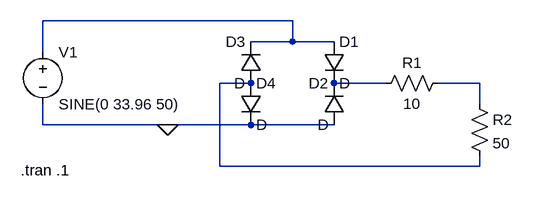
[diagram p0: schematic Rectificador.asc]
Rectificador.asc, the LTspice schematic file:
Version 4
SHEET 1 880 680
WIRE 448 112 64 112
WIRE 448 144 448 112
WIRE 448 144 384 144
WIRE 512 144 448 144
WIRE 64 160 64 112
WIRE 384 208 336 208
WIRE 592 208 512 208
WIRE 736 208 672 208
WIRE 736 240 736 208
WIRE 64 272 64 240
WIRE 256 272 64 272
WIRE 384 272 256 272
WIRE 512 272 384 272
WIRE 336 336 336 208
WIRE 736 336 736 320
WIRE 736 336 336 336
FLAG 256 272 0
SYMBOL voltage 64 144 R0
WINDOW 123 0 0 Left 0
WINDOW 39 0 0 Left 0
SYMATTR InstName V1
SYMATTR Value SINE(0 33.96 50)
SYMBOL diode 496 144 R0
SYMATTR InstName D1
SYMBOL diode 528 272 R180
WINDOW 0 24 64 Left 2
WINDOW 3 24 0 Left 2
SYMATTR InstName D2
SYMBOL diode 400 208 R180
WINDOW 0 24 64 Left 2
WINDOW 3 24 0 Left 2
SYMATTR InstName D3
SYMBOL diode 368 208 R0
SYMATTR InstName D4
SYMBOL res 688 192 R90
WINDOW 0 0 56 VBottom 2
WINDOW 3 32 56 VTop 2
SYMATTR InstName R1
SYMATTR Value 10
SYMBOL res 720 224 R0
SYMATTR InstName R2
SYMATTR Value 50
TEXT 30 342 Left 2 !.tran .1

The netlist it stands for:
* Rectificador.asc
V1 N001 0 SINE(0 33.96 50)
D1 N001 N003 D
D2 0 N003 D
D3 N002 N001 D
D4 N002 0 D
R1 N004 N003 10
R2 N004 N002 50
.model D D
.lib standard.dio
.tran .1
.backanno
.end